# EAGLE schematic Pololu Magnetic Encoder (EAGLE 6.3)
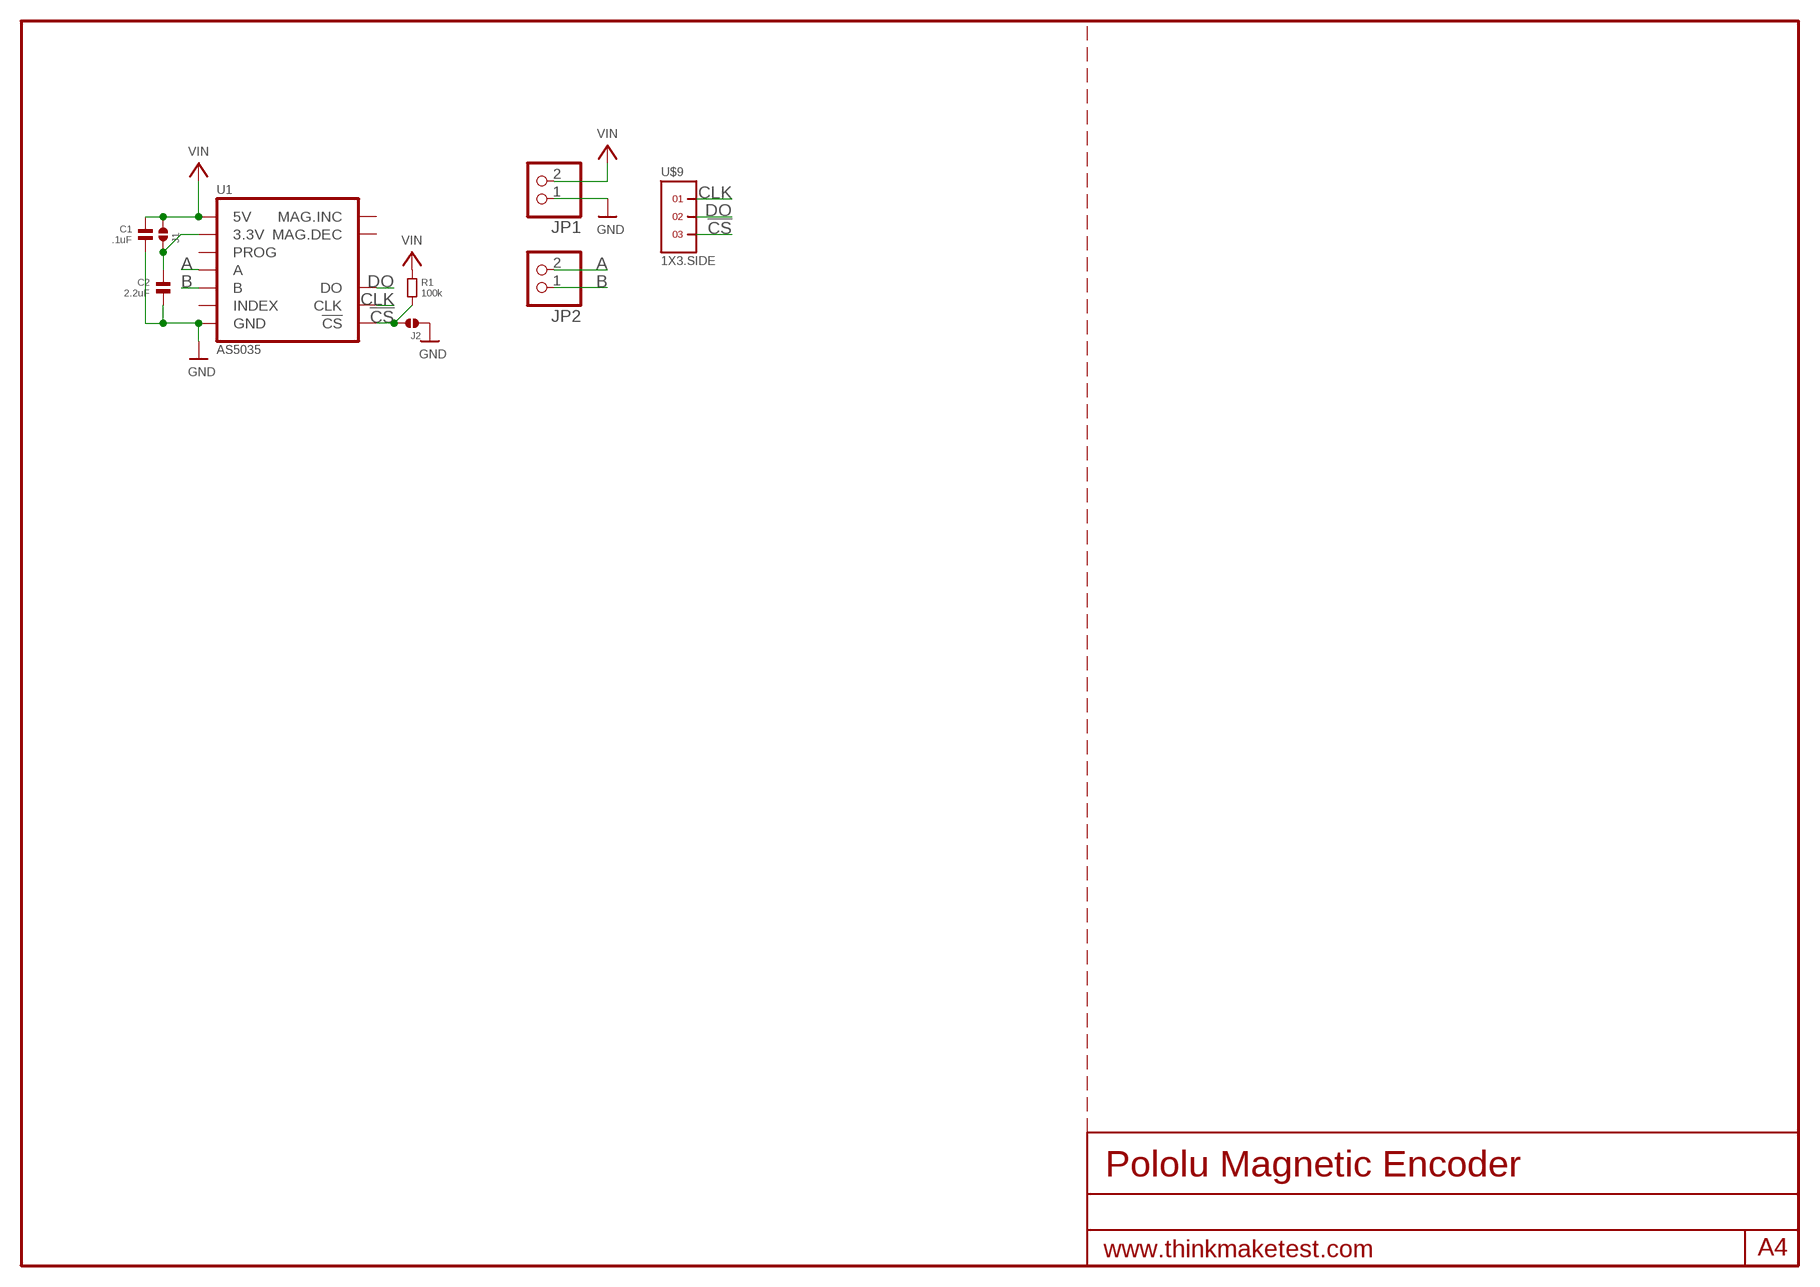
[diagram p0: schematic, sheet 1]

## Parts
C1  .1uF  CAPACITOR.0603  [0603]
C2  2.2uF  CAPACITOR.0603  [0603]
J1  SOLDERJUMPER.2.LRG.PASTE  [2.LRG.PASTE]
J2  SOLDERJUMPER.2.LRG.PASTE  [2.LRG.PASTE]
JP1  HEADER-1X2ROUND  [1X02_ROUND]
JP2  HEADER-1X2ROUND  [1X02_ROUND]
R1  100k  RESISTOR.0603  [0603]
U1  AS5035  [SSOP16]
U$9  1X3.SIDE  [1X3.SIDE]

## Nets
!CS: J2.2 R1.2 U1.11(!CS) U$9.3
A: JP2.2 U1.3(A)
B: JP2.1 U1.4(B)
CLK: U1.10(CLK) U$9.1
DO: U1.9(DO) U$9.2
GND: C1.2 C2.2 J2.1 JP1.1 U1.7(GND)
N$4: C2.1 J1.1 U1.15(3.3V)
VIN: C1.1 J1.2 JP1.2 R1.1 U1.16(5V)
Unconnected: U1.1(MAG.INC) U1.2(MAG.DEC) U1.6(INDEX) U1.8(PROG)

## Library data of the parts
C1 C2 = .standardparts:CAPACITOR
J1 J2 = .solderjumper:SOLDERJUMPER.2
JP1 JP2 = microbuilder:HEADER-1X2: PIN HEADER
R1 = .standardparts:RESISTOR
U1 = austriamicrosystems:AS5035
U$9 = .standardheaders:1X3